# Altium schematic sheet FPGA_POWER_AND_CONFIGURATION.SchDoc: FPGA Power and Configuration
size B; Author: Michael Jones; Engineer: Michael Jones; Organization: Group VIII Technology; Address1: 1652 W 820 N; Address2: Provo; Address3: UT  84601; Address4: 801-379-0118; DocumentNumber: 4; Revision: A3; SheetNumber: 3; SheetTotal: 7
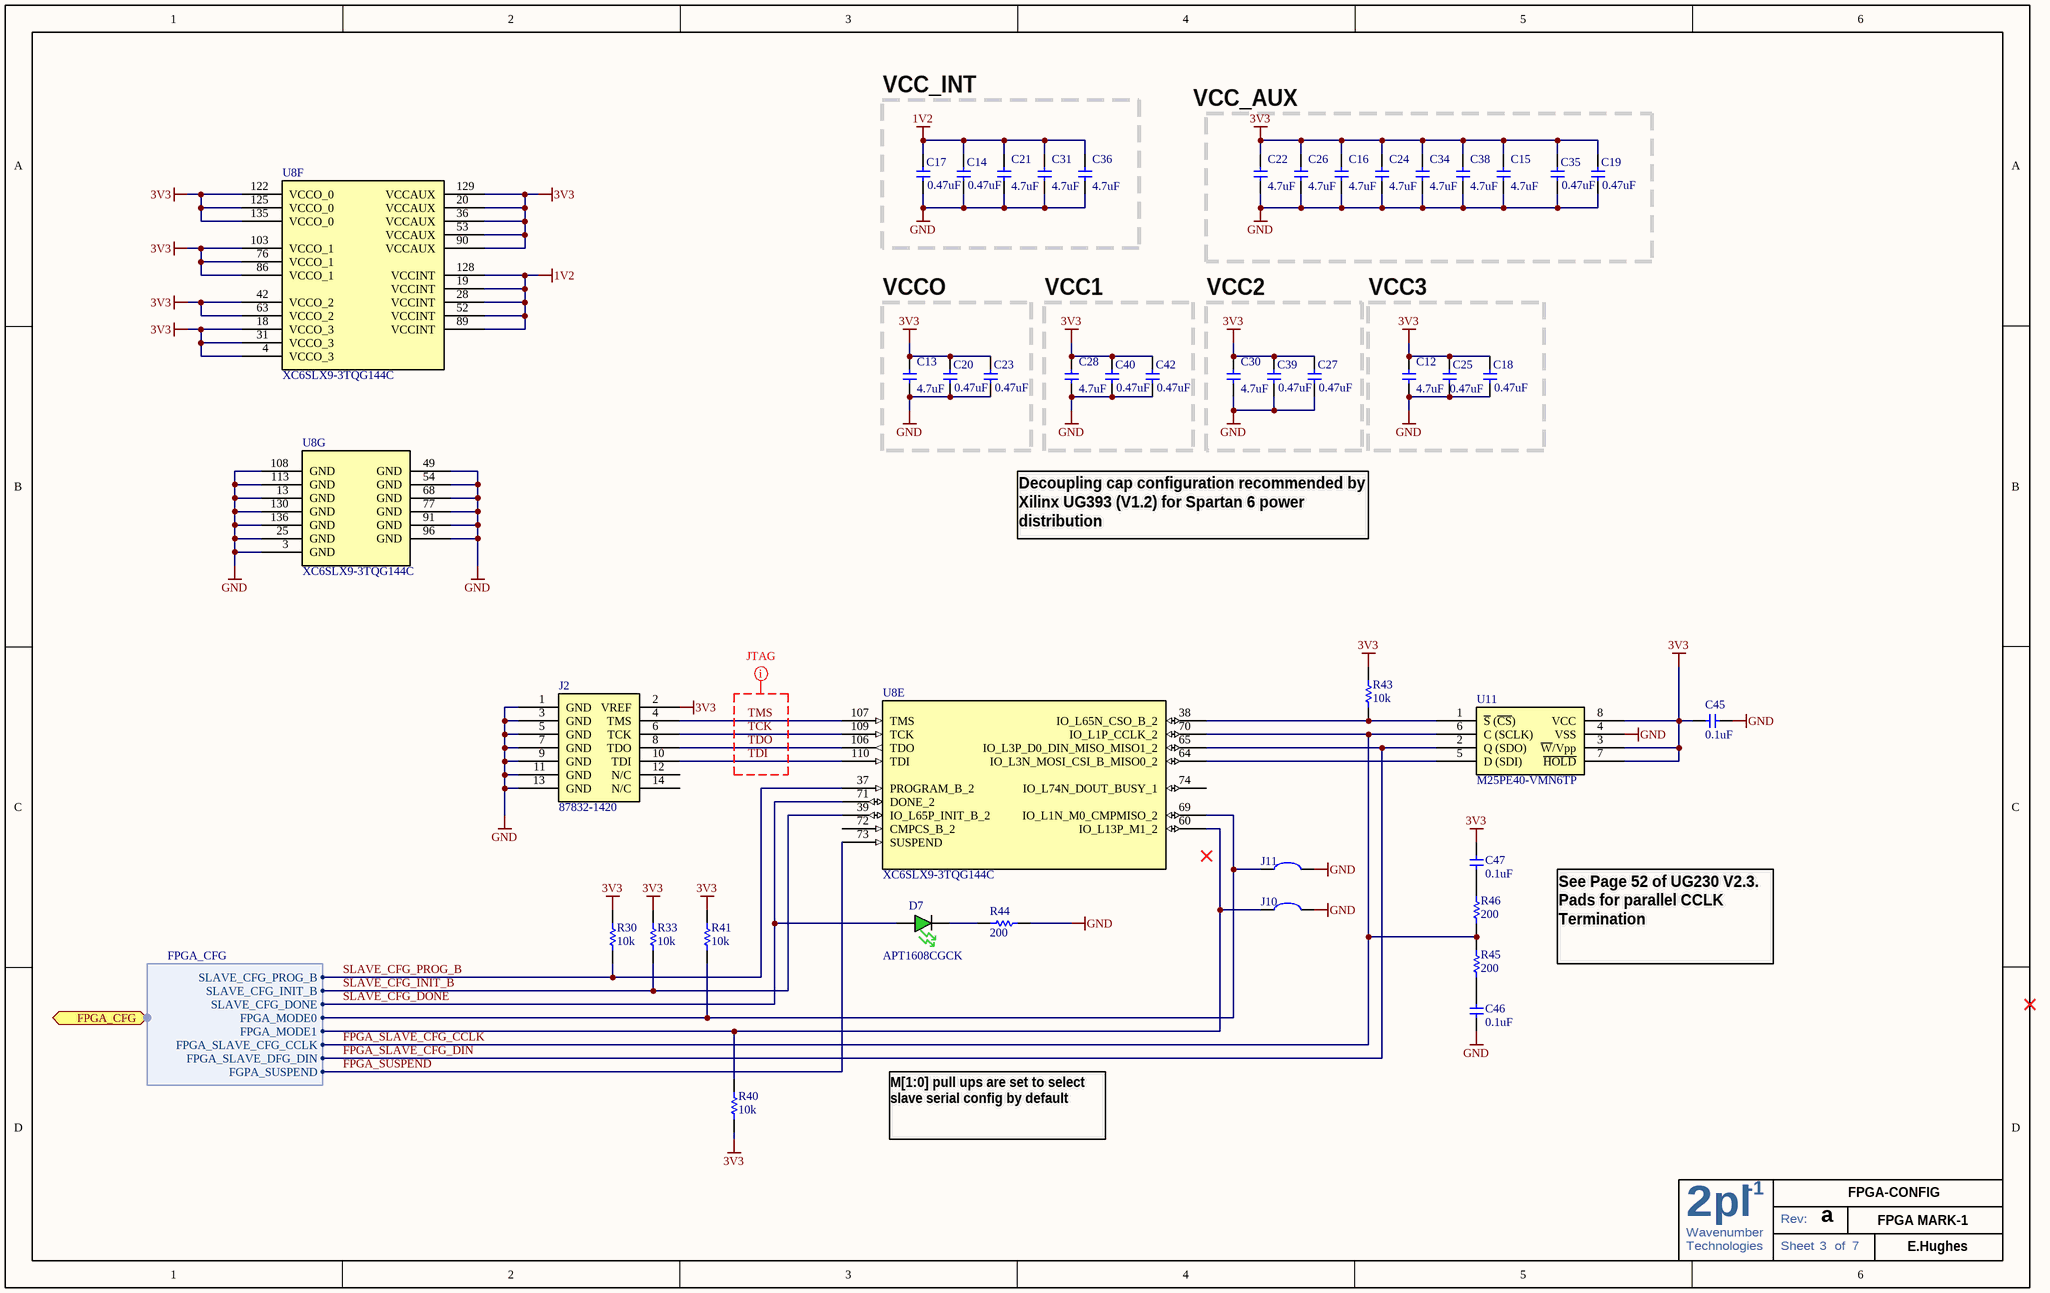
[diagram p0: FPGA_POWER_AND_CONFIGURATION.SchDoc]

## Parts
C12  4.7uF  [C0603]
C13  4.7uF  [C0603]
C14  0.47uF  [C0603]
C15  4.7uF  [C0603]
C16  4.7uF  [C0603]
C17  0.47uF  [C0603]
C18  0.47uF  [C0603]
C19  0.47uF  [C0603]
C20  0.47uF  [C0603]
C21  4.7uF  [C0603]
C22  4.7uF  [C0603]
C23  0.47uF  [C0603]
C24  4.7uF  [C0603]
C25  0.47uF  [C0603]
C26  4.7uF  [C0603]
C27  0.47uF  [C0603]
C28  4.7uF  [C0603]
C30  4.7uF  [C0603]
C31  4.7uF  [C0603]
C34  4.7uF  [C0603]
C35  0.47uF  [C0603]
C36  4.7uF  [C0603]
C38  4.7uF  [C0603]
C39  0.47uF  [C0603]
C40  0.47uF  [C0603]
C42  0.47uF  [C0603]
C45  0.1uF  [C0603]
C46  0.1uF  [C0603]
C47  0.1uF  [C0603]
D7  APT1608CGCK  [LED_0603 - GREEN]
J2  87832-1420  [87832-1420]
J10  Solder Jumper  [SOLDER_JUMPER]  (value not drawn)  (no BOM)
J11  Solder Jumper  [SOLDER_JUMPER]  (value not drawn)  (no BOM)
R30  10k  [R0603]
R33  10k  [R0603]
R40  10k  [R0603]
R41  10k  [R0603]
R43  10k  [R0603]
R44  200  [R0603]
R45  200  [R0603]
R46  200  [R0603]
U8  XC6SLX9-3TQG144C  [TQ144_L]  (parts E,F,G of 7)
U11  M25PE40-VMN6TP  [SOIC 8]

## Blocks framed on the sheet
VCC_INT: C14 C17 C21 C31 C36
VCCO: C13 C20 C23
VCC1: C28 C40 C42
VCC2: C27 C30 C39
VCC3: C12 C18 C25

## Ports
FPGA_CFG (harness FPGA_CFG)

## Harnesses
FPGA_CFG: SLAVE_CFG_PROG_B, SLAVE_CFG_INIT_B, SLAVE_CFG_DONE, FPGA_MODE0, FPGA_MODE1, FPGA_SLAVE_CFG_CCLK, FPGA_SLAVE_DFG_DIN, FGPA_SUSPEND

## Nets
1V2: C14.2 C17.2 C21.2 C31.2 C36.2 U8.19(VCCINT) U8.28(VCCINT) U8.52(VCCINT) U8.89(VCCINT) U8.128(VCCINT)
3V3: C12.2 C13.2 C15.2 C16.2 C18.2 C19.2 C20.2 C22.2 C23.2 C24.2 C25.2 C26.2 C27.2 C28.2 C30.2 C34.2 C35.2 C38.2 C39.2 C40.2 C42.2 C45.1 C47.2 J2.2(VREF) R30.2 R33.2 R40.1 R41.2 R43.2 U8.4(VCCO_3) U8.18(VCCO_3) U8.20(VCCAUX) U8.31(VCCO_3) U8.36(VCCAUX) U8.42(VCCO_2) U8.53(VCCAUX) U8.63(VCCO_2) U8.76(VCCO_1) U8.86(VCCO_1) U8.90(VCCAUX) U8.103(VCCO_1) U8.122(VCCO_0) U8.125(VCCO_0) U8.129(VCCAUX) U8.135(VCCO_0) U11.3(~{W}/Vpp) U11.7(~{HOLD}) U11.8(VCC)
GND: C12.1 C13.1 C14.1 C15.1 C16.1 C17.1 C18.1 C19.1 C20.1 C21.1 C22.1 C23.1 C24.1 C25.1 C26.1 C27.1 C28.1 C30.1 C31.1 C34.1 C35.1 C36.1 C38.1 C39.1 C40.1 C42.1 C45.2 C46.1 J2.1(GND) J2.3(GND) J2.5(GND) J2.7(GND) J2.9(GND) J2.11(GND) J2.13(GND) J10.2 J11.2 R44.2 U8.3(GND) U8.13(GND) U8.25(GND) U8.49(GND) U8.54(GND) U8.68(GND) U8.77(GND) U8.91(GND) U8.96(GND) U8.108(GND) U8.113(GND) U8.130(GND) U8.136(GND) U11.4(VSS)
FPGA_SLAVE_CFG_CCLK: R45.2 R46.1 U8.70(IO_L1P_CCLK_2) U11.6(C_(SCLK)) ; port FPGA_CFG.FPGA_SLAVE_CFG_CCLK
FPGA_SLAVE_CFG_DIN: U8.65(IO_L3P_D0_DIN_MISO_MISO1_2) U11.2(Q_(SDO)) ; port FPGA_CFG.FPGA_SLAVE_DFG_DIN
FPGA_SUSPEND: U8.73(SUSPEND) ; port FPGA_CFG.FGPA_SUSPEND
SLAVE_CFG_DONE: D7.A U8.71(DONE_2) ; port FPGA_CFG.SLAVE_CFG_DONE
SLAVE_CFG_INIT_B: R33.1 U8.39(IO_L65P_INIT_B_2) ; port FPGA_CFG.SLAVE_CFG_INIT_B
SLAVE_CFG_PROG_B: R30.1 U8.37(PROGRAM_B_2) ; port FPGA_CFG.SLAVE_CFG_PROG_B
TCK: J2.6(TCK) U8.109(TCK)
TDI: J2.10(TDI) U8.110(TDI)
TDO: J2.8(TDO) U8.106(TDO)
TMS: J2.4(TMS) U8.107(TMS)
NetC46_2: C46.2 R45.1
NetC47_1: C47.1 R46.2
NetD7_C: D7.C R44.1
NetJ10_1: J10.1 R40.2 U8.60(IO_L13P_M1_2) ; port FPGA_CFG.FPGA_MODE1
NetJ11_1: J11.1 R41.1 U8.69(IO_L1N_M0_CMPMISO_2) ; port FPGA_CFG.FPGA_MODE0
NetR43_1: R43.1 U8.38(IO_L65N_CSO_B_2) U11.1(~{S}_(~{CS}))
NetU8_64: U8.64(IO_L3N_MOSI_CSI_B_MISO0_2) U11.5(D_(SDI))

Not connected (* = marked no-connect by the designer): J2 12(N/C) 14(N/C); U8 72(CMPCS_B_2) 74(IO_L74N_DOUT_BUSY_1)

## Layout directives
net class JTAG: TCK, TDI, TDO, TMS

## Notes on the sheet
- VCC_AUX
- Decoupling cap configuration recommended by Xilinx UG393 (V1.2) for Spartan 6 power distribution
- See Page 52 of UG230 V2.3.   Pads for parallel CCLK Termination
- M[1:0] pull ups are set to select slave serial config by default
- a
- FPGA-CONFIG
- FPGA MARK-1
- E.Hughes
- 2
- Wavenumber
- pl
- -1
- Rev:
- Technologies
- Sheet
- of

## Library data of the parts
C12 C13 C15 C16 C21 C22 C24 C26 C28 C30 C31 C34 C36 C38 = GRM188R60J475KE19D: CAP CER 4.7UF 6.3V X5R 0603; Manufacturer: Murata Electronics North America; Capacitance: 4.7µF; Tolerance: ±10%; Supplier 1: Digi-Key; Supplier Part Number 1: 490-3297-1-ND; Manufacturer Part Number: GRM188R60J475KE19D; RoHS: RoHS Compliant; Category: Capacitors; Stock 1: 714091; Pricing 1: 10=0.214, 50=0.148, 100=0.1142, 250=0.08204, 500=0.0585, 1000=0.04281 (USD); Voltage - Rated: 6.3V; Temperature Coefficient: X5R; Mounting Type: Surface Mount, MLCC; Operating Temperature: -55°C ~ 85°C; Applications: General Purpose; Ratings: -; Package / Case: 0603 (1608 Metric); Size / Dimension: 0.063" L x 0.031" W (1.60mm x 0.80mm); Height: -; Thickness: 0.035" (0.90mm); Lead Spacing: -; Features: -; Packaging: Cut Tape (CT); Lead Style: -; ComponentLink1URL: http://search.murata.co.jp/Ceramy/image/img/PDF/ENG/GRM188R60J475KE19.pdf; ComponentLink1Description: http://search.murata.co.jp/Ceramy/image/img/PDF/ENG/GRM188R60J475KE19.pdf; Value: 4.7uF
C14 C17-C20 C23 C25 C27 C35 C39 C40 C42 = GCM188R71E474KA64D: CAP CER .47UF 25V X7R 0603; Manufacturer: Murata Electronics North America; Capacitance: 0.47µF; Tolerance: ±10%; Supplier 1: Digi-Key; Supplier Part Number 1: 490-4776-1-ND; Manufacturer Part Number: GCM188R71E474KA64D; RoHS: RoHS Compliant; Category: Capacitors; Stock 1: 120782; Pricing 1: 10=0.248, 50=0.1444, 100=0.1155, 250=0.08252, 500=0.0561, 1000=0.04538 (USD); Voltage - Rated: 25V; Temperature Coefficient: X7R; Mounting Type: Surface Mount, MLCC; Operating Temperature: -55°C ~ 125°C; Applications: Automotive; Ratings: AEC-Q200; Package / Case: 0603 (1608 Metric); Size / Dimension: 0.063" L x 0.031" W (1.60mm x 0.80mm); Height: -; Thickness: 0.035" (0.90mm); Lead Spacing: -; Features: -; Packaging: Cut Tape (CT); Lead Style: -; ComponentLink1URL: http://search.murata.co.jp/Ceramy/image/img/PDF/ENG/GCM188R71E474KA64.pdf; ComponentLink1Description: http://search.murata.co.jp/Ceramy/image/img/PDF/ENG/GCM188R71E474KA64.pdf; Value: 0.47uF
C45-C47 = GRM188R71H104KA93D: CAP CER .1UF 50V 10% X7R 0603; Manufacturer: Murata Electronics North America; Capacitance: 0.1µF; Manufacturer Part Number: GRM188R71H104KA93D; Value: CAP CER .1UF 50V 10% X7R 0603; Supplier 1: Digi-Key; Supplier Part Number 1: 490-1519-1-ND; RoHS: RoHS Compliant; Category: Capacitors; Stock 1: 9370695; Pricing 1: 10=0.037, 100=0.0221, 500=0.01276, 1000=0.00884 (USD); Voltage - Rated: 50V; Tolerance: ±10%; Temperature Coefficient: X7R; Mounting Type: Surface Mount, MLCC; Operating Temperature: -55°C ~ 125°C; Features: -; Applications: General Purpose; Ratings: -; Package / Case: 0603 (1608 Metric); Size / Dimension: 0.063" L x 0.031" W (1.60mm x 0.80mm); Lead Spacing: -; Thickness: 0.80mm; Packaging: Cut Tape (CT); Lead Style: -; ComponentLink1URL: http://search.murata.co.jp/Ceramy/image/img/PDF/ENG/GRM188R71H104KA93.pdf; ComponentLink1Description: http://search.murata.co.jp/Ceramy/image/img/PDF/ENG/GRM188R71H104KA93.pdf
D7 = APT1608CGCK: LED 1.6X0.8MM 570NM GRN CLR SMD; Manufacturer: Kingbright Corp; Color: Green; Current - Test: 20mA; Wavelength - Peak: 574nm; Millicandela Rating: 50mcd; Voltage - Forward (Vf) Typ: 2.1V; Lens Type: Clear; Lens Style/Size: Rectangle, 1.2mm x 0.8mm; Viewing Angle: 120°; Value: APT1608CGCK; Supplier 1: Digi-Key; Supplier Part Number 1: 754-1116-2-ND; Manufacturer Part Number: APT1608CGCK; RoHS: RoHS Compliant; Category: Optoelectronics; Stock 1: 94000; Pricing 1: 2000=0.051, 6000=0.045, 10000=0.043 (USD); Luminous Flux @ Current - Test: -; Wavelength - Dominant: 570nm; Size / Dimension: 1.60mm L x 0.80mm W; Height: 0.75mm; Package / Case: 0603 (1608 Metric); Mounting Type: Surface Mount; Packaging: Tape & Reel (TR); ComponentLink1URL: http://www.us.kingbright.com/images/catalog/SPEC/APT1608CGCK.pdf; ComponentLink1Description: http://www.us.kingbright.com/images/catalog/SPEC/APT1608CGCK.pdf
J2 = XILINX_JTAG: CONN HEADER 14POS 2MM VERT SMD; Manufacturer: Molex Connector Corporation; Source Part Number: WM18641-ND; Manufacturer Part Number: 87832-1420; Source: Digikey; Value: CONN HEADER 14POS 2MM VERT SMD; ROHS Certificate: *
J10 J11 = Solder Jumper: Solder/Configuration Jumper; Manufacturer: n/a; Manufacturer Part Number: n/a; Source: n/a; Source Part Number: n/a; ROHS Certificate: n/a
R30 R33 R40 R41 R43 = ERJ-3EKF1002V: RES 10.0K OHM 1/10W 1% 0603 SMD; Manufacturer: Panasonic - ECG; Power (Watts): 0.1W, 1/10W; Temperature Coefficient: ±100ppm/°C; Manufacturer Part Number: ERJ-3EKF1002V; Value: 10k; Supplier 1: Digi-Key; RoHS: RoHS Compliant; Category: Resistors; Stock 1: 11168880; Pricing 1: 1=0.04, 50=0.015, 100=0.0114, 250=0.00844, 500=0.00624, 1000=0.00416 (USD); Resistance (Ohms): 10.0K; Composition: Thick Film; Features: -; Tolerance: ±1%; Size / Dimension: 0.063" L x 0.031" W (1.60mm x 0.80mm); Height: 0.018" (0.45mm); Lead Style: Surface Mount (SMD - SMT); Packaging: Cut Tape (CT); Package / Case: 0603 (1608 Metric); ComponentLink1URL: http://industrial.panasonic.com/www-cgi/jvcr13pz.cgi?E+PZ+3+AOA0002+ERJ3EKF1002V+7+WW; ComponentLink1Description: http://industrial.panasonic.com/www-cgi/jvcr13pz.cgi?E+PZ+3+AOA0002+ERJ3EKF1002V+7+WW; Supplier Part Number 1: P10.0KHCT-ND
R44-R46 = ERJ-3EKF2000V: RES 200 OHM 1/10W 1% 0603 SMD; Manufacturer: Panasonic - ECG; Power (Watts): 0.1W, 1/10W; Temperature Coefficient: ±100ppm/°C; Manufacturer Part Number: ERJ-3EKF2000V; Value: RES 200 OHM 1/10W 1% 0603 SMD; Supplier 1: Digi-Key; Supplier Part Number 1: P200HCT-ND; RoHS: RoHS Compliant; Category: Resistors; Stock 1: 1279595; Pricing 1: 1=0.04, 50=0.015, 100=0.0114, 250=0.00844, 500=0.00624, 1000=0.00416 (USD); Resistance (Ohms): 200; Composition: Thick Film; Features: -; Tolerance: ±1%; Size / Dimension: 0.063" L x 0.031" W (1.60mm x 0.80mm); Height: 0.018" (0.45mm); Lead Style: Surface Mount (SMD - SMT); Packaging: Cut Tape (CT); Package / Case: 0603 (1608 Metric); ComponentLink1URL: http://industrial.panasonic.com/www-cgi/jvcr13pz.cgi?E+PZ+3+AOA0002+ERJ3EKF2000V+7+WW; ComponentLink1Description: http://industrial.panasonic.com/www-cgi/jvcr13pz.cgi?E+PZ+3+AOA0002+ERJ3EKF2000V+7+WW
U8 = XC6SLX9-3TQG144C: IC FPAG SPARTAN 6 9K 144TQFP; Manufacturer: Xilinx Inc; Number of Logic Elements/Cells: 9152; Number of LABs/CLBs: 715; Total RAM Bits: 589824; Number of I /O: 102; Voltage - Supply: 1.14 V ~ 1.26 V; Supplier 1: Digi-Key; Supplier Part Number 1: 122-1747-ND; Manufacturer Part Number: XC6SLX9-3TQG144C; RoHS: RoHS Compliant; Category: Integrated Circuits (ICs); Stock 1: 77; Pricing 1: 1=17.22 (USD); Number of Gates: -; Mounting Type: Surface Mount; Operating Temperature: 0°C ~ 85°C; Package / Case: 144-LQFP; Supplier Device Package: 144-TQFP (20x20); ComponentLink1URL: http://www.xilinx.com/support/documentation/data_sheets/ds160.pdf; ComponentLink1Description: http://www.xilinx.com/support/documentation/data_sheets/ds160.pdf; Value: XC6SLX9-3TQG144C
U11 = M25PE40-VMN6TP: IC FLASH 4MBIT 75MHZ 8SOIC; Manufacturer: Numonyx - A DIVISION OF MICRON SEMICONDUCTOR PRODUCTS, INC.; Memory Size: 4M (512K x 8); Interface: SPI, 3-Wire Serial; Voltage - Supply: 2.7 V ~ 3.6 V; Supplier 1: Digi-Key; Supplier Part Number 1: M25PE40-VMN6TPCT-ND; Manufacturer Part Number: M25PE40-VMN6TP; RoHS: RoHS Compliant; Category: Integrated Circuits (ICs); Pricing 1: 1=1.86, 10=1.666, 25=1.47, 100=1.323, 250=1.15152, 500=1.029, 1000=0.8085 (USD); Format - Memory: FLASH; Memory Type: FLASH; Speed: 75MHz; Operating Temperature: -40°C ~ 85°C; Package / Case: 8-SOIC (0.154", 3.90mm Width); Supplier Device Package: 8-SO; Packaging: Cut Tape (CT); ComponentLink1URL: http://media.digikey.com/pdf/Data%20Sheets/Micron%20Technology%20Inc%20PDFs/M25PE40.pdf; ComponentLink1Description: http://media.digikey.com/pdf/Data%20Sheets/Micron%20Technology%20Inc%20PDFs/M25PE40.pdf; Stock 1: 1941; Value: M25PE40-VMN6TP